# EAGLE design ADXL377 Breakout (EAGLE 6.5.0)
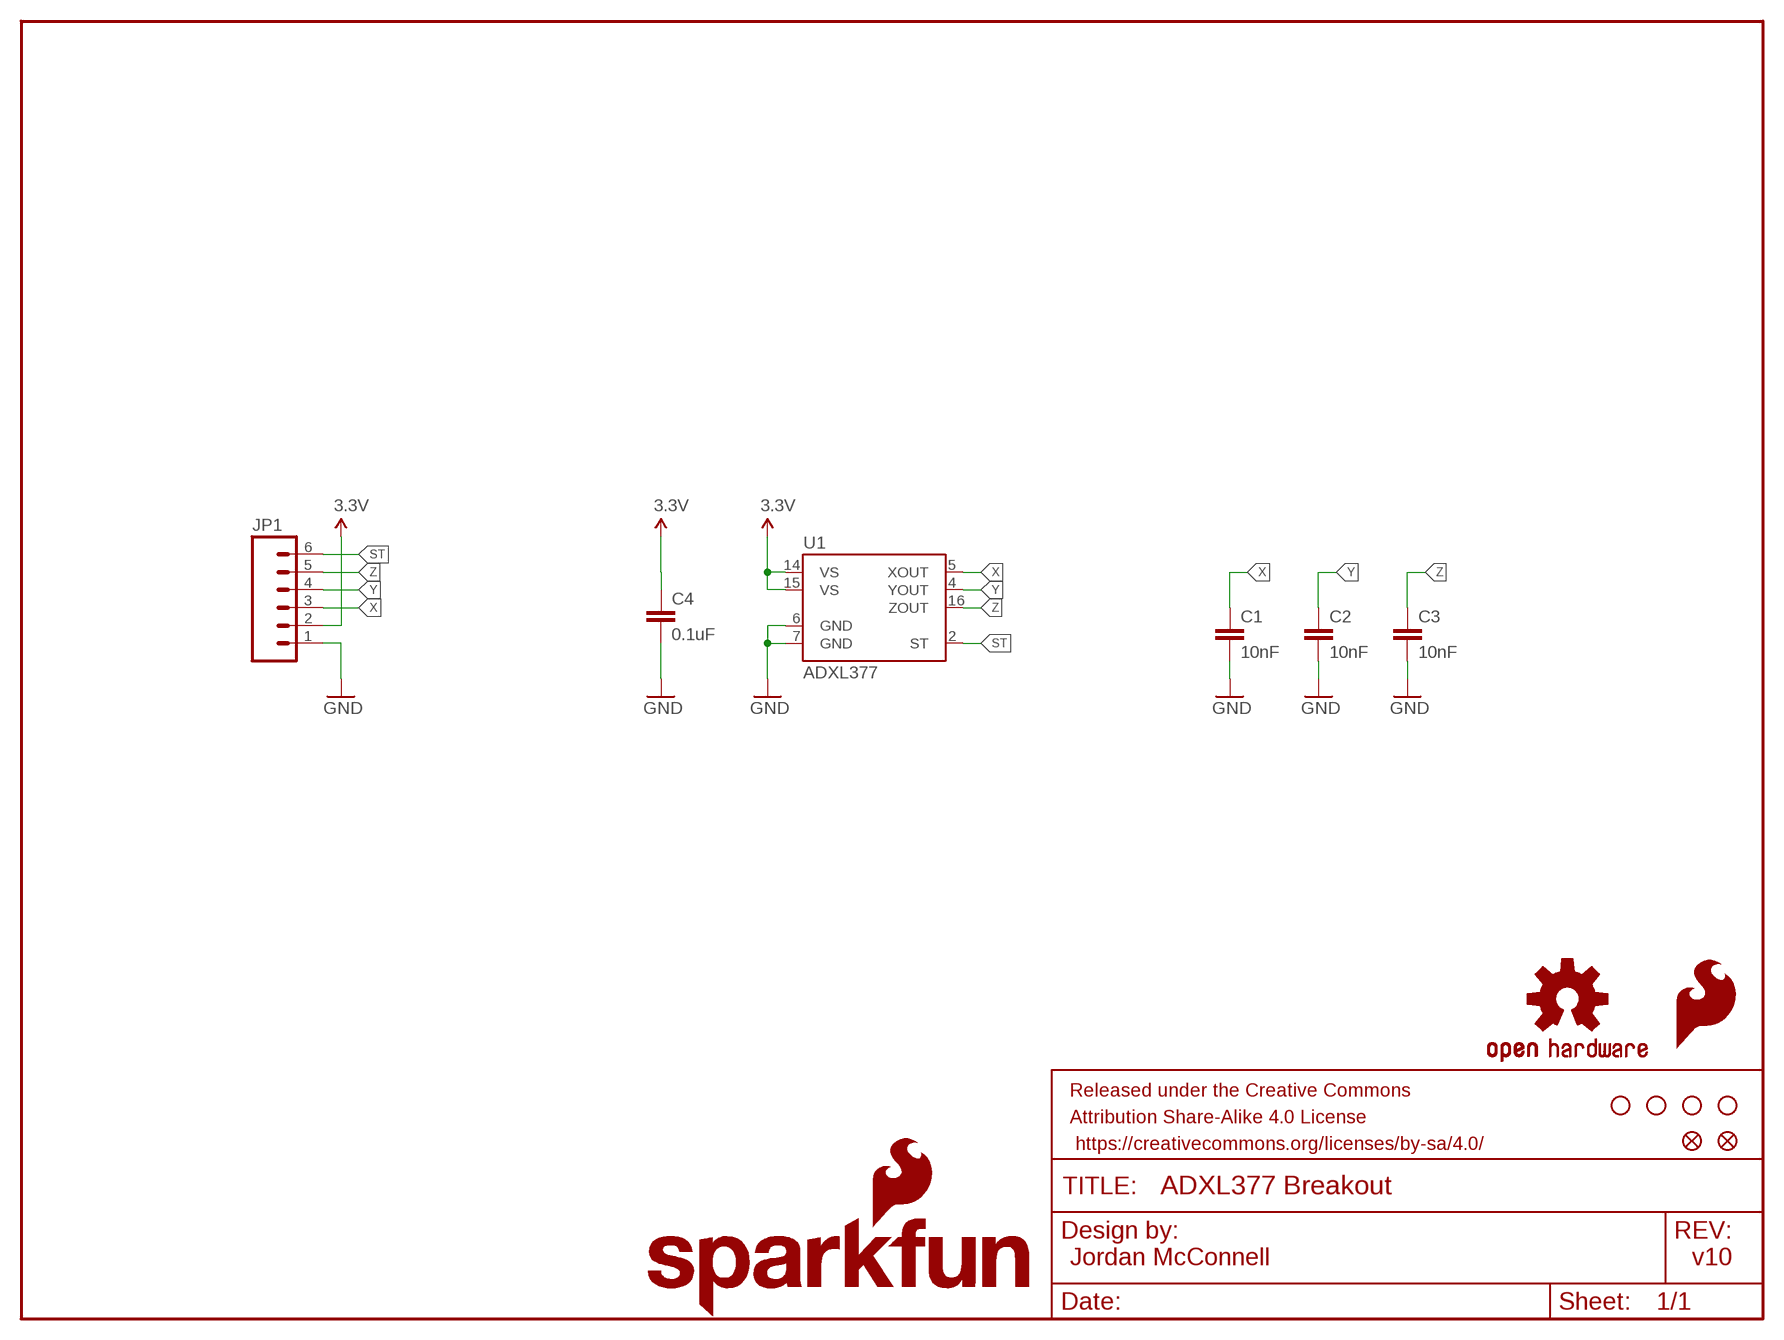
[diagram p0: schematic, sheet 1]

## Parts
C1  10nF  10NF/10000PF-50V-10%(0603)  [0603-CAP]
C2  10nF  10NF/10000PF-50V-10%(0603)  [0603-CAP]
C3  10nF  10NF/10000PF-50V-10%(0603)  [0603-CAP]
C4  0.1uF  0.1UF-25V(+80/-20%)(0603)  [0603-CAP]
FID1  FIDUCIAL1X2  [FIDUCIAL-1X2]
FID2  FIDUCIAL1X2  [FIDUCIAL-1X2]
FRAME1  FRAME-LETTER  [CREATIVE_COMMONS]
JP1  M06SIP  [1X06]
LOGO1  SFE_LOGO_FLAME.1_INCH  [SFE_LOGO_FLAME_.1]
LOGO2  OSHW-LOGOS  [OSHW-LOGO-S]
LOGO5  SFE_LOGO_NAME_FLAME.1_INCH  [SFE_LOGO_NAME_FLAME_.1]
STANDOFF1  STAND-OFF  [STAND-OFF]
STANDOFF2  STAND-OFF  [STAND-OFF]
STANDOFF3  STAND-OFF  [STAND-OFF]
STANDOFF4  STAND-OFF  [STAND-OFF]
U1  ADXL377  [LFCSP_LQ-16]

## Nets
3.3V: C4.1 JP1.2 U1.14(VS) U1.15(VS)
GND: C1.2 C2.2 C3.2 C4.2 JP1.1 U1.6(GND) U1.7(GND)
ST: JP1.6 U1.2(ST)
X: C1.1 JP1.3 U1.5(XOUT)
Y: C2.1 JP1.4 U1.4(YOUT)
Z: C3.1 JP1.5 U1.16(ZOUT)

## Notes on the sheet
- Jordan McConnell | v10

## Library data of the parts
C1-C3 = SparkFun-Capacitors:10NF/10000PF-50V-10%(0603): CAP-00867; PROD_ID: CAP-00867
C4 = SparkFun-Capacitors:0.1UF-25V(+80/-20%)(0603): CAP-00810 Ceramic Standard decoupling cap; PROD_ID: CAP-00810
FID1 FID2 = SparkFun-Aesthetics:FIDUCIAL: Fiducial Alignment Points Various fiducial points for machine vision alignment.
FRAME1 = SparkFun-Aesthetics:FRAME-LETTER: Schematic Frame Standard 8.5x11 US Letter frame
JP1 = SparkFun-Connectors:M06: Header 6 Standard 6-pin 0.1" header. Use with straight break away headers (SKU : PRT-00116), right angle break away headers (PRT-00553), swiss pins (PRT-00743), machine pins (PRT-00117), and female headers (PRT-00115). Molex polarized connector foot print use with SKU : PRT-08094 with associated crimp pins and housings. NOTES ON THE VARIANTS LOCK and LOCK_LONGPADS... This footprint was designed to help hold the alignment of a through-hole component (i.e. 6-pin header) while soldering it into place. You may notice that each hole has been shifted either up or down by 0.005 of an inch from it's more standard position (which is a perfectly straight line). This slight alteration caused the pins (the squares in the middle) to touch the edges of the holes. Because they are alternating, it causes a "brace" to hold the component in place. 0.005 has proven to be the perfect amount of "off-center" position when using our standard breakaway headers. Although looks a little odd when you look at the bare footprint, once you have a header in there, the alteration is very hard to notice. Also,if you push a header all the way into place, it is covered up entirely on the bottom side. This idea of altering the position of holes to aid alignment will be further integrated into the Sparkfun Library for other footprints. It can help hold any component with 3 or more connection pins.
LOGO1 = SparkFun-Aesthetics:SFE_LOGO_FLAME: SFE Logo, flame only This is the SparkFun flame logo. The logo on the schematic will always be the same size; the package variant is the height of the flame. Default layer for the logo on the board is tSilk.
LOGO2 = SparkFun-Aesthetics:OSHW-LOGO: Open Source Hardware Logo This logo indicates the piece of hardware it is found on incorporates a OSHW license and/or adheres to the definition of open source hardware found here: http://freedomdefined.org/OSHW
LOGO5 = SparkFun-Aesthetics:SFE_LOGO_NAME_FLAME: SFE Logo, name and flame This is the SparkFun full logo. The logo on the schematic will always be the same size; the package variant is the height of the flame part of the logo. Default layer for the logo on the board is tSilk.
STANDOFF1-STANDOFF4 = SparkFun-Electromechanical:STAND-OFF: #4 Stand Off This is the mechanical footprint for a #4 phillips button head screw. Use the keepout ring to avoid running the screw head into surrounding components. SKU : PRT-00447
U1 = SparkFun-Sensors:ADXL377: ADXL377 Low Power 3-Axis ±200 g Accelerometer with Analog Output.

## Board
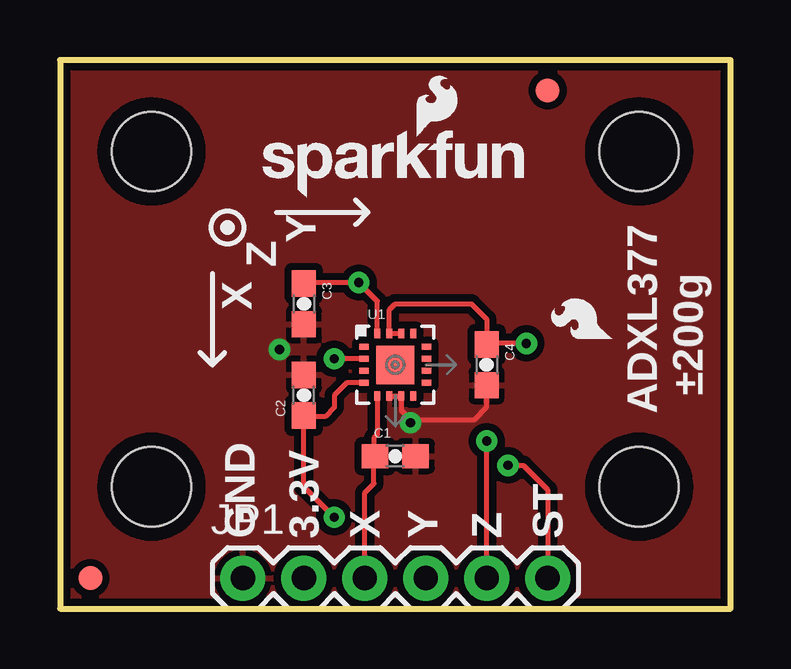
[diagram p1: board, top side]
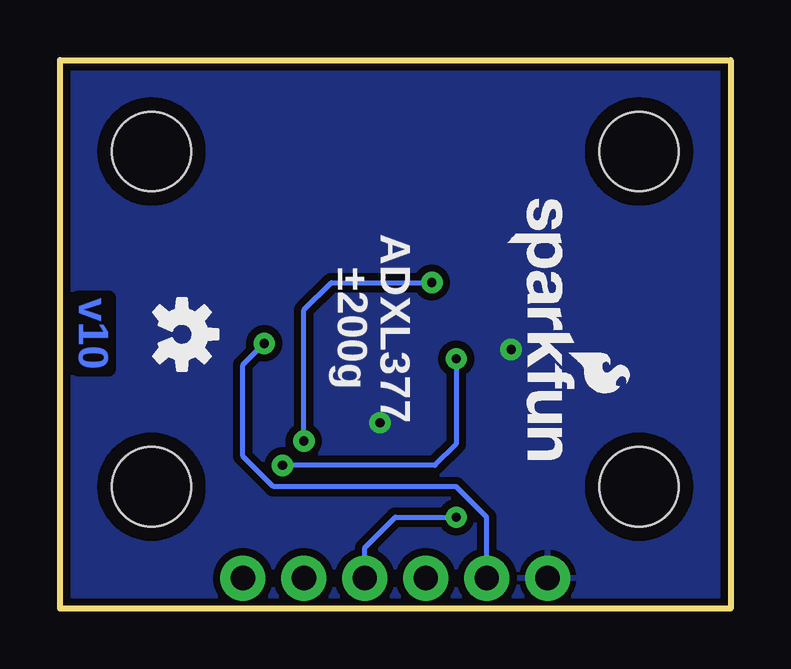
[diagram p2: board, bottom side, seen from below]

Size 27.94 x 22.86 mm. Coordinates in mm from the lower left corner, seen from the top.
Outline: 0,0 27.94,0 27.94,22.86 0,22.86 0,0
Copper layers (1*16): Top 0.035mm / dielectric 1.5mm / Bottom 0.035mm
Design rules "SparkFun": minimum track width 8mil, minimum drill 20mil, track to track 8mil, track to pad 8mil, pad to pad 8mil, via to via 8mil, smd to smd 8mil, copper to edge 8mil, drill to drill 8mil, minimum pad ring 12mil, minimum via ring 10mil, stop-mask expansion 4mil, vias tented up to drill 20mil, thermal gap 10mil

### Footprints (pad centres in the part's own frame; a part is rotated, then mirrored left to right if it is on the bottom)
0603-CAP = smd 1.1 x 1: 1 -0.85,0; 2 0.85,0
FIDUCIAL-1X2 = smd 1 x 1: 1 0,0
1X06 = drill 1.016 pad 1.88: 1 0,0; 2 2.54,0; 3 5.08,0; 4 7.62,0; 5 10.16,0; 6 12.7,0
STAND-OFF = hole 3.302: 0,0
LFCSP_LQ-16 = smd 0.4 x 0.25: 1 -1.3,0.75; 2 -1.3,0.25; 3 -1.3,-0.25; 4 -1.3,-0.75; 9 1.3,-0.75; 10 1.3,-0.25; 11 1.3,0.25; 12 1.3,0.75 | smd 0.25 x 0.4: 5 -0.75,-1.3; 6 -0.25,-1.3; 7 0.25,-1.3; 8 0.75,-1.3; 13 0.75,1.3; 14 0.25,1.3; 15 -0.25,1.3; 16 -0.75,1.3 | smd 1.6 x 1.6: EXP 0,0

### Placement (x,y rotation side)
C1  13.97,6.35 0 top
C2  10.16,8.89 90 top
C3  10.16,12.7 270 top
C4  17.78,10.16 270 top
FID1  20.32,21.59 0 top
FID2  1.27,1.27 0 top
FRAME1  -5.08,-12.7 0 top  (outside the outline)
JP1  7.62,1.27 0 top
LOGO1  23.37,10.92 90 top
LOGO2  22.86,11.43 270 bottom
LOGO3  SFE_LOGO_NAME_FLAME.1_INCH  [SFE_LOGO_NAME_FLAME_.1]  9.4,17.53 270 bottom
LOGO5  8,17.02 0 top
STANDOFF1  24.13,19.05 0 top
STANDOFF2  3.81,5.08 0 top
STANDOFF3  3.81,19.05 0 top
STANDOFF4  24.13,5.08 0 top
U1  13.97,10.16 0 top

### Tracks (layer width: path | path; a pad name or v marks a point on that pad's centre or on a via)
3.3V  (via drill 0.38)
  Top 0.203: U1.14 U1.15 13.72,12.45 13.97,12.7 17.14,12.7 17.78,12.06 C4.1 17.82,11.05 v19.43,11.05
  Bottom 0.203: JP1.2 10.16,3.81 11.43,5.08 19.05,5.08 20.32,6.35 20.32,10.16 v19.43,11.05
GND  (via drill 0.38)
  Top 0.203: U1.6 U1.7 14.22,8.26 14.61,7.87 17.27,7.87 17.78,8.38 C4.2
  other vias: 9.14,10.79 14.61,7.75
  pour Bottom (isolate 0.305): 0,22.86 27.94,22.86 27.94,0 0,0
  pour Top (isolate 0.305): 0,0 0,22.86 27.94,22.86 27.94,0
ST  (via drill 0.38)
  Top 0.203: U1.2 v11.43,10.41 | v18.67,5.97 19.3,5.97 20.32,4.95 JP1.6
  Bottom 0.203: v11.43,10.41 11.43,6.86 12.32,5.97 v18.67,5.97
X
  Top 0.203: JP1.3 12.7,4.83 13.08,5.21 13.08,6.31 C1.1 13.08,6.39 13.08,7.11 13.22,7.25 U1.5
Y  (via drill 0.38)
  Top 0.203: v11.43,3.81 10.16,5.08 C2.1 10.2,8 11.05,8 11.43,8.38 11.43,8.89 11.95,9.41 U1.4
  Bottom 0.203: JP1.4 15.24,2.54 13.97,3.81 v11.43,3.81
Z  (via drill 0.38)
  Top 0.203: U1.16 13.22,12.81 v12.45,13.59 11.43,13.59 | 11.43,13.59 10.2,13.59 | 10.2,13.59 C3.1 10.2,13.59 | JP1.5 v17.78,6.99 | 11.43,13.59 10.2,13.59
  Bottom 0.203: v17.78,6.99 17.78,12.45 16.64,13.59 v12.45,13.59

### Text on the board
Bottom: v10
tPlace: Y | Z | X | ±200g | ADXL377 | GND | 3.3V | X | Y | Z | ST
bPlace: ADXL377 | ±200g
tNames: Jordan McConnell